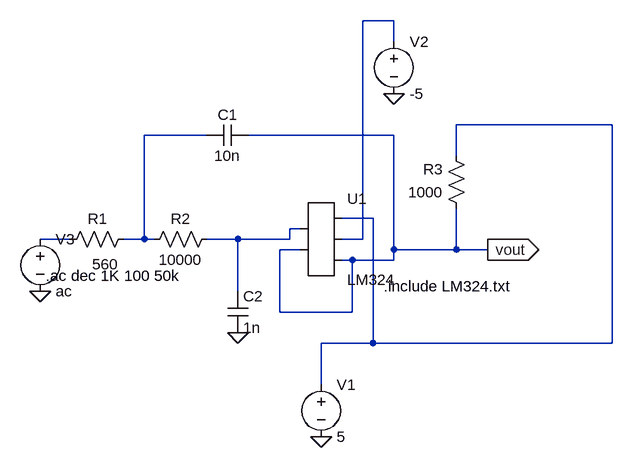
[diagram p0: schematic lab13_1.asc]
lab13_1.asc, the LTspice schematic file:
Version 4
SHEET 1 1076 680
WIRE 320 -272 272 -272
WIRE 320 -240 320 -272
WIRE 656 -112 416 -112
WIRE 32 -96 -64 -96
WIRE 320 -96 96 -96
WIRE 416 -64 416 -112
WIRE 288 32 240 32
WIRE 176 48 160 48
WIRE -176 64 -224 64
WIRE -64 64 -64 -96
WIRE -64 64 -96 64
WIRE -48 64 -64 64
WIRE 80 64 32 64
WIRE 160 64 160 48
WIRE 160 64 80 64
WIRE 272 64 272 -272
WIRE 272 64 240 64
WIRE 176 80 144 80
WIRE 320 80 320 -96
WIRE 416 80 416 16
WIRE 416 80 320 80
WIRE 464 80 416 80
WIRE 256 96 240 96
WIRE 320 96 320 80
WIRE 320 96 256 96
WIRE 80 144 80 64
WIRE 144 176 144 80
WIRE 256 176 256 96
WIRE 256 176 144 176
WIRE 288 224 288 32
WIRE 288 224 208 224
WIRE 656 224 656 -112
WIRE 656 224 288 224
WIRE 208 288 208 224
FLAG 80 208 0
FLAG 464 80 vout
IOPIN 464 80 Out
FLAG -224 144 0
FLAG 208 368 0
FLAG 320 -160 0
SYMBOL res -80 48 R90
WINDOW 0 0 56 VBottom 2
WINDOW 3 39 44 VTop 2
SYMATTR InstName R1
SYMATTR Value 560
SYMBOL res 48 48 R90
WINDOW 0 0 56 VBottom 2
WINDOW 3 32 56 VTop 2
SYMATTR InstName R2
SYMATTR Value 10000
SYMBOL res 432 32 R180
WINDOW 0 36 76 Left 2
WINDOW 3 36 40 Left 2
SYMATTR InstName R3
SYMATTR Value 1000
SYMBOL cap 64 144 R0
SYMATTR InstName C2
SYMATTR Value 1n
SYMBOL cap 96 -112 R90
WINDOW 0 0 32 VBottom 2
WINDOW 3 32 32 VTop 2
SYMATTR InstName C1
SYMATTR Value 10n
SYMBOL voltage 208 272 R0
WINDOW 123 0 0 Left 0
WINDOW 39 0 0 Left 0
SYMATTR InstName V1
SYMATTR Value 5
SYMBOL voltage 320 -256 R0
WINDOW 123 0 0 Left 0
WINDOW 39 0 0 Left 0
SYMATTR InstName V2
SYMATTR Value -5
SYMBOL AutoGenerated\\LM324 208 64 R0
SYMATTR InstName U1
SYMBOL voltage -224 48 R0
WINDOW 123 0 0 Left 0
WINDOW 39 0 0 Left 0
SYMATTR InstName V3
SYMATTR Value ac
TEXT -216 120 Left 2 !.ac dec 1K 100 50k
TEXT 304 136 Left 2 !.include LM324.txt

The netlist it stands for:
* lab13_1.asc
R1 N003 N005 560
R2 N004 N003 10000
R3 vout N002 1000
C2 N004 0 1n
C1 vout N003 10n
V1 N002 0 5
V2 N001 0 -5
* U1: LM324 (symbol AutoGenerated\LM324 not available, pins judged from their places): pin1=N004 pin2=vout pin3=N002 pin4=N001 pin5=vout
V3 N005 0 ac
.ac dec 1K 100 50k
.include LM324.txt
.backanno
.end